# Altium project triumvi_integrated_v2_base.PrjPcb
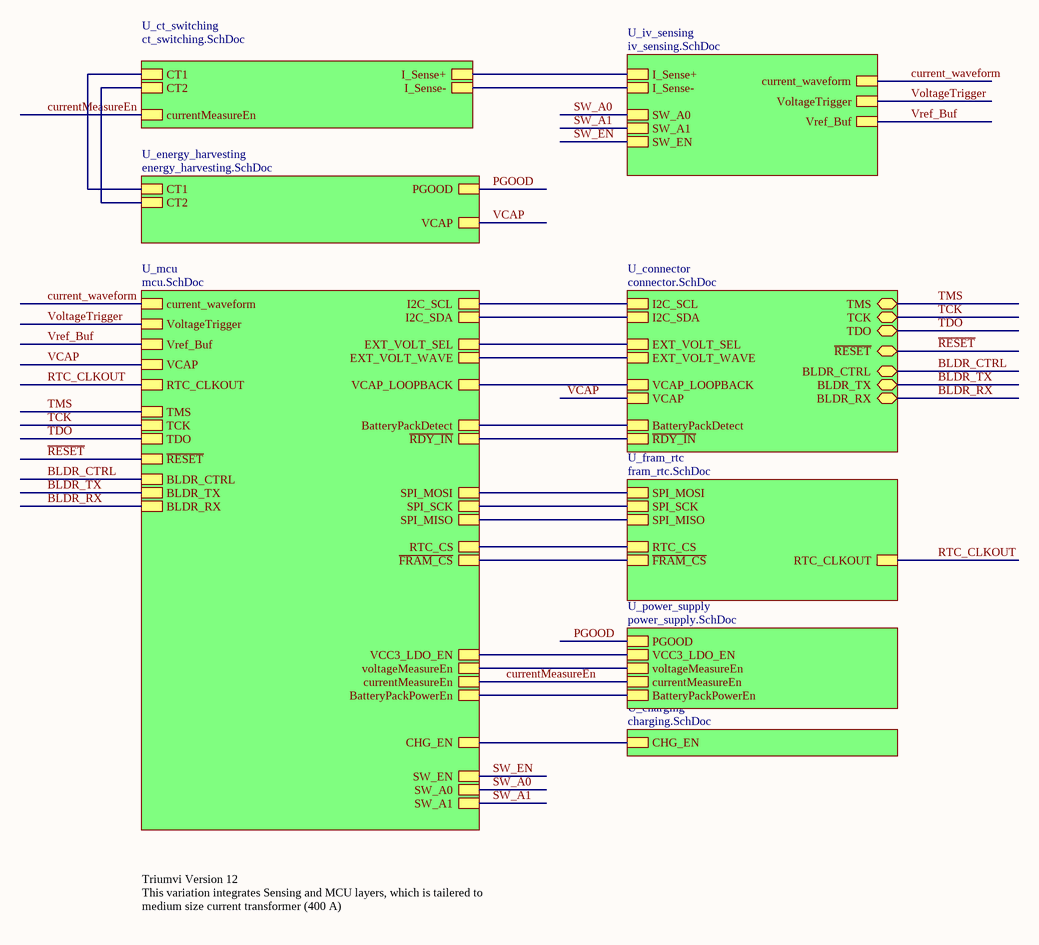
[diagram p0: top.SchDoc]
9 sheets, 139 parts. Net scope: hierarchical (ports join the sheet entries above them; power ports are global).
Board files: triumvi_integrated_v2_base.PcbDoc, triumvi_integrated_v2_base_panel.PcbDoc
Sheets:
  top.SchDoc
    U_charging = charging.SchDoc
    U_connector = connector.SchDoc
    U_ct_switching = ct_switching.SchDoc
    U_energy_harvesting = energy_harvesting.SchDoc
    U_fram_rtc = fram_rtc.SchDoc
    U_iv_sensing = iv_sensing.SchDoc
    U_mcu = mcu.SchDoc
    U_power_supply = power_supply.SchDoc

## Sheet top.SchDoc: Triumvi - Top
size Letter; Author: Ye-Sheng Kuo; Revision: 12; SheetNumber: 1; SheetTotal: 9

### Sub-sheets
U_charging = charging.SchDoc: CHG_EN
U_connector = connector.SchDoc: I2C_SCL, I2C_SDA, EXT_VOLT_SEL, EXT_VOLT_WAVE, BatteryPackDetect, VCAP_LOOPBACK, VCAP, ~{RDY_IN}, TMS, TCK, TDO, BLDR_CTRL, BLDR_TX, BLDR_RX, ~{RESET}
U_ct_switching = ct_switching.SchDoc: CT1, CT2, currentMeasureEn, I_Sense+, I_Sense-
U_energy_harvesting = energy_harvesting.SchDoc: CT1, CT2, PGOOD, VCAP
U_fram_rtc = fram_rtc.SchDoc: SPI_MOSI, SPI_SCK, SPI_MISO, RTC_CS, ~{FRAM_CS}, RTC_CLKOUT
U_iv_sensing = iv_sensing.SchDoc: current_waveform, Vref_Buf, VoltageTrigger, I_Sense+, I_Sense-, SW_A0, SW_A1, SW_EN
U_mcu = mcu.SchDoc: current_waveform, Vref_Buf, voltageMeasureEn, currentMeasureEn, VoltageTrigger, ~{FRAM_CS}, SPI_SCK, SPI_MOSI, SPI_MISO, RTC_CS, I2C_SCL, I2C_SDA, EXT_VOLT_SEL, EXT_VOLT_WAVE, TDO, BLDR_CTRL, BLDR_TX, BLDR_RX, ~{RESET}, TMS, TCK, VCC3_LDO_EN, BatteryPackDetect, VCAP_LOOPBACK, VCAP, ~{RDY_IN}, SW_EN, RTC_CLKOUT, SW_A0, SW_A1, CHG_EN, BatteryPackPowerEn
U_power_supply = power_supply.SchDoc: PGOOD, VCC3_LDO_EN, voltageMeasureEn, currentMeasureEn, BatteryPackPowerEn

### Nets
BatteryPackDetect: sheet U_connector/BatteryPackDetect, sheet U_mcu/BatteryPackDetect
BLDR_CTRL: sheet U_connector/BLDR_CTRL, sheet U_mcu/BLDR_CTRL  [project net BLD_CTRL]
BLDR_RX: sheet U_connector/BLDR_RX, sheet U_mcu/BLDR_RX  [project net BLD_RX]
BLDR_TX: sheet U_connector/BLDR_TX, sheet U_mcu/BLDR_TX  [project net BLD_TX]
CT1: sheet U_ct_switching/CT1, sheet U_energy_harvesting/CT1
CT2: sheet U_ct_switching/CT2, sheet U_energy_harvesting/CT2
current_waveform: sheet U_iv_sensing/current_waveform, sheet U_mcu/current_waveform
currentMeasureEn: sheet U_ct_switching/currentMeasureEn, sheet U_mcu/currentMeasureEn, sheet U_power_supply/currentMeasureEn
EXT_VOLT_SEL: sheet U_connector/EXT_VOLT_SEL, sheet U_mcu/EXT_VOLT_SEL
EXT_VOLT_WAVE: sheet U_connector/EXT_VOLT_WAVE, sheet U_mcu/EXT_VOLT_WAVE
I2C_SCL: sheet U_connector/I2C_SCL, sheet U_mcu/I2C_SCL
I2C_SDA: sheet U_connector/I2C_SDA, sheet U_mcu/I2C_SDA
in+: sheet U_ct_switching/I_Sense+, sheet U_iv_sensing/I_Sense+
in-: sheet U_ct_switching/I_Sense-, sheet U_iv_sensing/I_Sense-
PGOOD: sheet U_energy_harvesting/PGOOD, sheet U_power_supply/PGOOD
~{RDY_IN}: sheet U_connector/~{RDY_IN}, sheet U_mcu/~{RDY_IN}
~{RESET}: sheet U_connector/~{RESET}, sheet U_mcu/~{RESET}
RTC_CLKOUT: sheet U_fram_rtc/RTC_CLKOUT, sheet U_mcu/RTC_CLKOUT
RTC_CS: sheet U_fram_rtc/RTC_CS, sheet U_mcu/RTC_CS
SPI_CLK: sheet U_fram_rtc/SPI_SCK, sheet U_mcu/SPI_SCK
SPI_MISO: sheet U_fram_rtc/SPI_MISO, sheet U_mcu/SPI_MISO
SPI_MOSI: sheet U_fram_rtc/SPI_MOSI, sheet U_mcu/SPI_MOSI
SW_A0: sheet U_iv_sensing/SW_A0, sheet U_mcu/SW_A0
SW_A1: sheet U_iv_sensing/SW_A1, sheet U_mcu/SW_A1
SW_EN: sheet U_iv_sensing/SW_EN, sheet U_mcu/SW_EN
TCK: sheet U_connector/TCK, sheet U_mcu/TCK
TDO: sheet U_connector/TDO, sheet U_mcu/TDO
TMS: sheet U_connector/TMS, sheet U_mcu/TMS
VCAP: sheet U_connector/VCAP, sheet U_energy_harvesting/VCAP, sheet U_mcu/VCAP
VCAP_LOOPBACK: sheet U_connector/VCAP_LOOPBACK, sheet U_mcu/VCAP_LOOPBACK
voltageMeasureEn: sheet U_mcu/voltageMeasureEn, sheet U_power_supply/voltageMeasureEn
VoltageTrigger: sheet U_iv_sensing/VoltageTrigger, sheet U_mcu/VoltageTrigger
Vref_Buf: sheet U_iv_sensing/Vref_Buf, sheet U_mcu/Vref_Buf
NetQ13_5: sheet U_mcu/BatteryPackPowerEn, sheet U_power_supply/BatteryPackPowerEn
NetR4_1: sheet U_charging/CHG_EN, sheet U_mcu/CHG_EN
NetU4_1: sheet U_fram_rtc/~{FRAM_CS}, sheet U_mcu/~{FRAM_CS}
NetU9_11: sheet U_mcu/VCC3_LDO_EN, sheet U_power_supply/VCC3_LDO_EN

### Notes on the sheet
- Triumvi Version 12
  This variation integrates Sensing and MCU layers, which is tailered to medium size current transformer (400 A)
- Title
- Date:
- Author:
- Revision:
- Sheet
- of
- University of Michigan
- File:

## Sheet charging.SchDoc: Triumvi - Charging
size Letter; Author: Ye-Sheng Kuo; Revision: 12; SheetNumber: 9; SheetTotal: 9
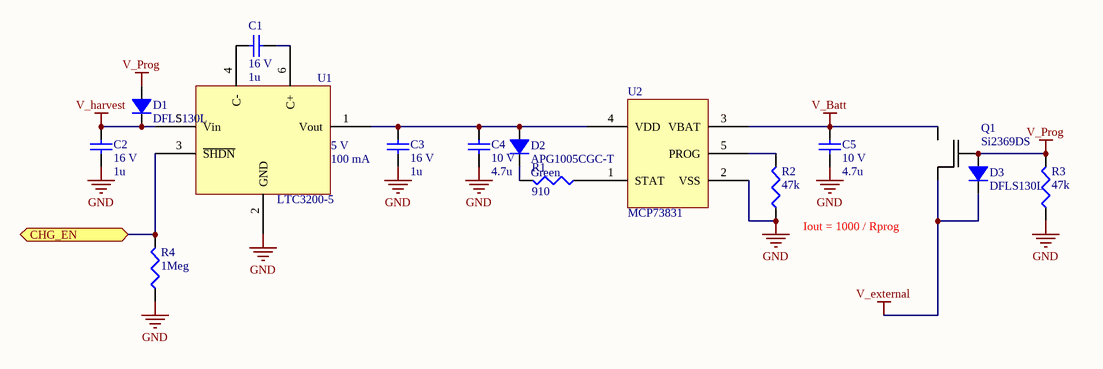
[diagram p1: charging.SchDoc]

### Parts
C1  voltage rated: 16 V  [0603]  (hidden comment: 1u)
C2  voltage rated: 16 V  [0603]  (hidden comment: 1u)
C3  voltage rated: 16 V  [0603]  (hidden comment: 1u)
C4  voltage rated: 10 V  [0603]  (hidden comment: 4.7u)
C5  voltage rated: 10 V  [0603]  (hidden comment: 4.7u)
D1  DFLS130L  [PowerDI123]
D2  APG1005CGC-T  value Green  [0402 - LED]
D3  DFLS130L  [PowerDI123]
Q1  Si2369DS  [SOT23-3]
R1  910  [0402]
R2  47k  [0402]
R3  47k  [0402]
R4  1Meg  [0402]
U1  LTC3200-5  Vout: 5 V  Iout: 100 mA  [SOT23-6]
U2  MCP73831  [TSOT23-5]

### Ports
CHG_EN

### Nets
GND: C2.1 C3.1 C4.2 C5.2 R2.2 R3.2 R4.2 U1.2(GND) U2.2(VSS)
V_Batt: C5.1 Q1.2(S) U2.3(VBAT)
V_external: D3.2 Q1.3(D)
V_harvest: C2.2 D1.2 U1.5(Vin)
V_Prog: D1.1 D3.1 Q1.1(G) R3.1
NetC1_1: C1.1 U1.4(C-)
NetC1_2: C1.2 U1.6(C+)
NetC3_2: C3.2 C4.1 D2.1 U1.1(Vout) U2.4(VDD)
NetD2_2: D2.2 R1.1
NetR1_2: R1.2 U2.1(STAT)
NetR2_1: R2.1 U2.5(PROG)
NetR4_1: R4.1 U1.3(~{SHDN}) ; port CHG_EN

### Notes on the sheet
- (near R2) Iout = 1000 / Rprog
- Title
- Date:
- Author:
- Revision:
- Sheet
- of
- University of Michigan
- File:

### Library data of the parts
C1-C3 = C1608X7R1C105K080AC: 1µF ±10% 16V Ceramic Capacitor X7R 0603; Manufacture: TDK; tolerance: 10%; package: 0603; Temperature Coefficient: X7R; Manufacturer Part Number: C1608X7R1C105K080AC; Supplier 1: Digi-Key; Supplier Part Number 1: 445-1604-1-ND; Value: 1u
C4 C5 = CGB3B1X5R1A475K055AC: 4.7µF ±10% 10V Ceramic Capacitor X5R 0603; Manufacture: TDK; tolerance: 10%; package: 0603; Supplier 1: Digi-Key; Supplier Part Number 1: 445-7482-1-ND; Value: 4.7u; Temperature Coefficient: X5R; Manufacturer Part Number: CGB3B1X5R1A475K055AC
D1 D3 = DFLS130L: 1.0A SURFACE MOUNT SCHOTTKY BARRIER RECTIFIER; Manufacturer: Diodes Incorporated; Forward Voltage @ If: 0.21 V @ 0.1 A; reverse current: 0.26 mA @ 5V; power: 556 mW; Manufacturer Part Number: DFLS130L; diode type: SCHOTTKY BARRIER; Supplier 1: Digi-Key; Supplier Part Number 1: DFLS130LDICT-ND
D2 = APG1005CGC-T: Green 571nm LED Indication - Discrete 2V 0402 (1005 Metric); Manufacturer: Kingbright; Current @ VF: 20 mA; package: 0402; Forward Voltage: 2 V; Manufacturer Part Number: APG1005CGC-T; Wavelength: 571 nm; Supplier 1: Digi-Key; Supplier Part Number 1: 754-1811-1-ND
Q1 = Si2369DS: P-Channel 30-V (D-S) MOSFET; Supplier 1: Digi-Key; Supplier Part Number 1: SI2369DS-T1-GE3CT-ND
R1 = CRCW0402910RFKED: RES SMD 910 OHM 1% 1/16W 0402; Manufacturer: Vishay Dale; Temperature Coefficient: 100 ppm/C; Tolerance: 1%; Power: 1/16 W; package: 0402; Supplier 1: Digi-Key; Supplier Part Number 1: 541-910LCT-ND; value: 910; Manufacturer Part Number: CRCW0402910RFKED
R2 R3 = CRCW040247K0FKED: RES SMD 47K OHM 1% 1/16W 0402; Manufacturer: Vishay Dale; Temperature Coefficient: 100 ppm/C; Tolerance: 1%; Power: 1/16 W; package: 0402; Supplier 1: Digi-Key; Supplier Part Number 1: 541-47.0KLCT-ND; value: 47k; Manufacturer Part Number: CRCW040247K0FKED
R4 = CRCW04021M00FKED: RES SMD 1M OHM 1% 1/16W 0402; Manufacturer: Vishay Dale; Temperature Coefficient: 100 ppm/C; Tolerance: 1%; Power: 1/16 W; Supplier 1: Digi-Key; Supplier Part Number 1: 541-1.00MLCT-ND; package: 0402; value: 1Meg; Manufacturer Part Number: CRCW04021M00FKED
U1 = LTC3200ES6-5#TRMPBF: Low Noise, Regulated   Charge Pump DC/DC Converters; Supplier 1: Digi-Key; Supplier Part Number 1: LTC3200ES6-5#TRMPBFCT-ND
U2 = MCP73831: Miniature Single-Cell, Fully Integrated Li-Ion,  Li-Polymer Charge Management Controllers; Supplier 1: Digi-Key; Supplier Part Number 1: MCP73831T-2ATI/OTCT-ND

## Sheet connector.SchDoc: Triumvi - Connectors
size Letter; Author: Ye-Sheng Kuo; Revision: 12; SheetNumber: 8; SheetTotal: 9
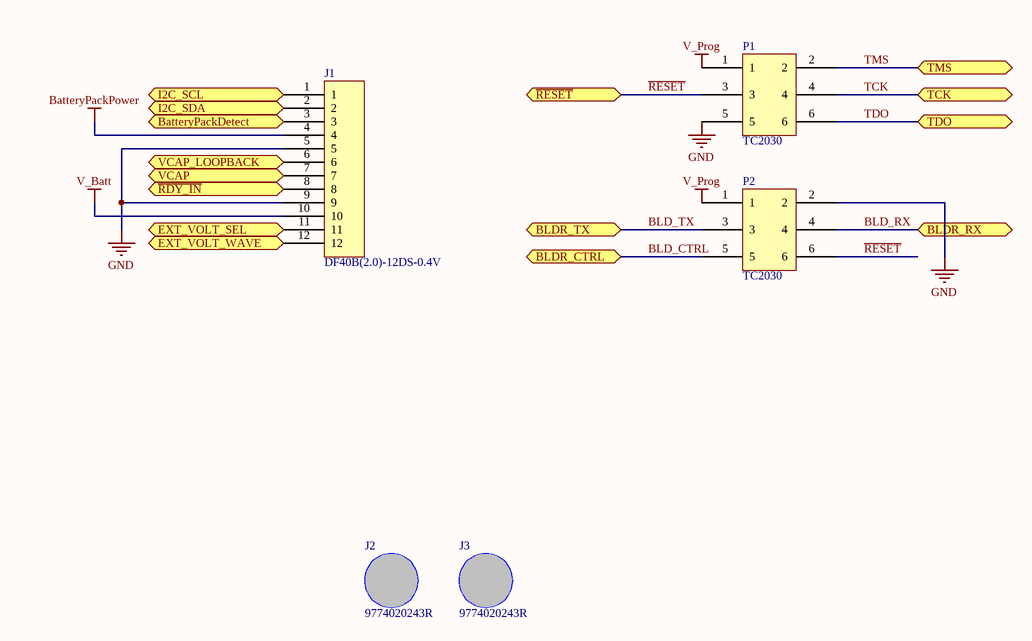
[diagram p2: connector.SchDoc]

### Parts
J1  DF40B(2.0)-12DS-0.4V  [DF40B(2.0)-12DS-0.4V]
J2  9774020243R  [9774020243R]
J3  9774020243R  [9774020243R]
P1  TC2030  [TC2030-IDC-NLFP]
P2  TC2030  [TC2030-IDC-NLFP]

### Ports
BatteryPackDetect, BLDR_CTRL, BLDR_RX, BLDR_TX, EXT_VOLT_SEL, EXT_VOLT_WAVE, I2C_SCL, I2C_SDA, TCK, TDO, TMS, VCAP, VCAP_LOOPBACK, ~{RDY_IN}, ~{RESET}

### Nets
BatteryPackPower: J1.4
GND: J1.5 J1.9 P1.5 P2.2
V_Batt: J1.10
V_Prog: P1.1 P2.1
BatteryPackDetect: J1.3 ; port BatteryPackDetect
BLD_CTRL: P2.5 ; port BLDR_CTRL
BLD_RX: P2.4 ; port BLDR_RX
BLD_TX: P2.3 ; port BLDR_TX
EXT_VOLT_SEL: J1.11 ; port EXT_VOLT_SEL
EXT_VOLT_WAVE: J1.12 ; port EXT_VOLT_WAVE
I2C_SCL: J1.1 ; port I2C_SCL
I2C_SDA: J1.2 ; port I2C_SDA
~{RDY_IN}: J1.8 ; port ~{RDY_IN}
~{RESET}: P1.3 P2.6 ; port ~{RESET}
TCK: P1.4 ; port TCK
TDO: P1.6 ; port TDO
TMS: P1.2 ; port TMS
VCAP: J1.7 ; port VCAP
VCAP_LOOPBACK: J1.6 ; port VCAP_LOOPBACK

### Notes on the sheet
- Title
- Date:
- Author:
- Revision:
- Sheet
- of
- University of Michigan
- File:

### Library data of the parts
J1 = DF40B(2.0)-12DS-0.4V: Hirose BM20 Series, 0.4mm pitch, 2mm stack height, 12 pos, header; Supplier 1: Digi-Key; Supplier Part Number 1: H124594CT-ND
J2 J3 = 9774020243R: 2 mm stack height, m2 standoff; Supplier 1: Digi-Key; Supplier Part Number 1: 732-7073-1-ND
P1 P2 = TC2030: TC2030-MCP-NL; Note: Not a part

## Sheet ct_switching.SchDoc: Triumvi - CT Switching
size Letter; Author: Ye-Sheng Kuo; Revision: 12; SheetNumber: 7; SheetTotal: 9
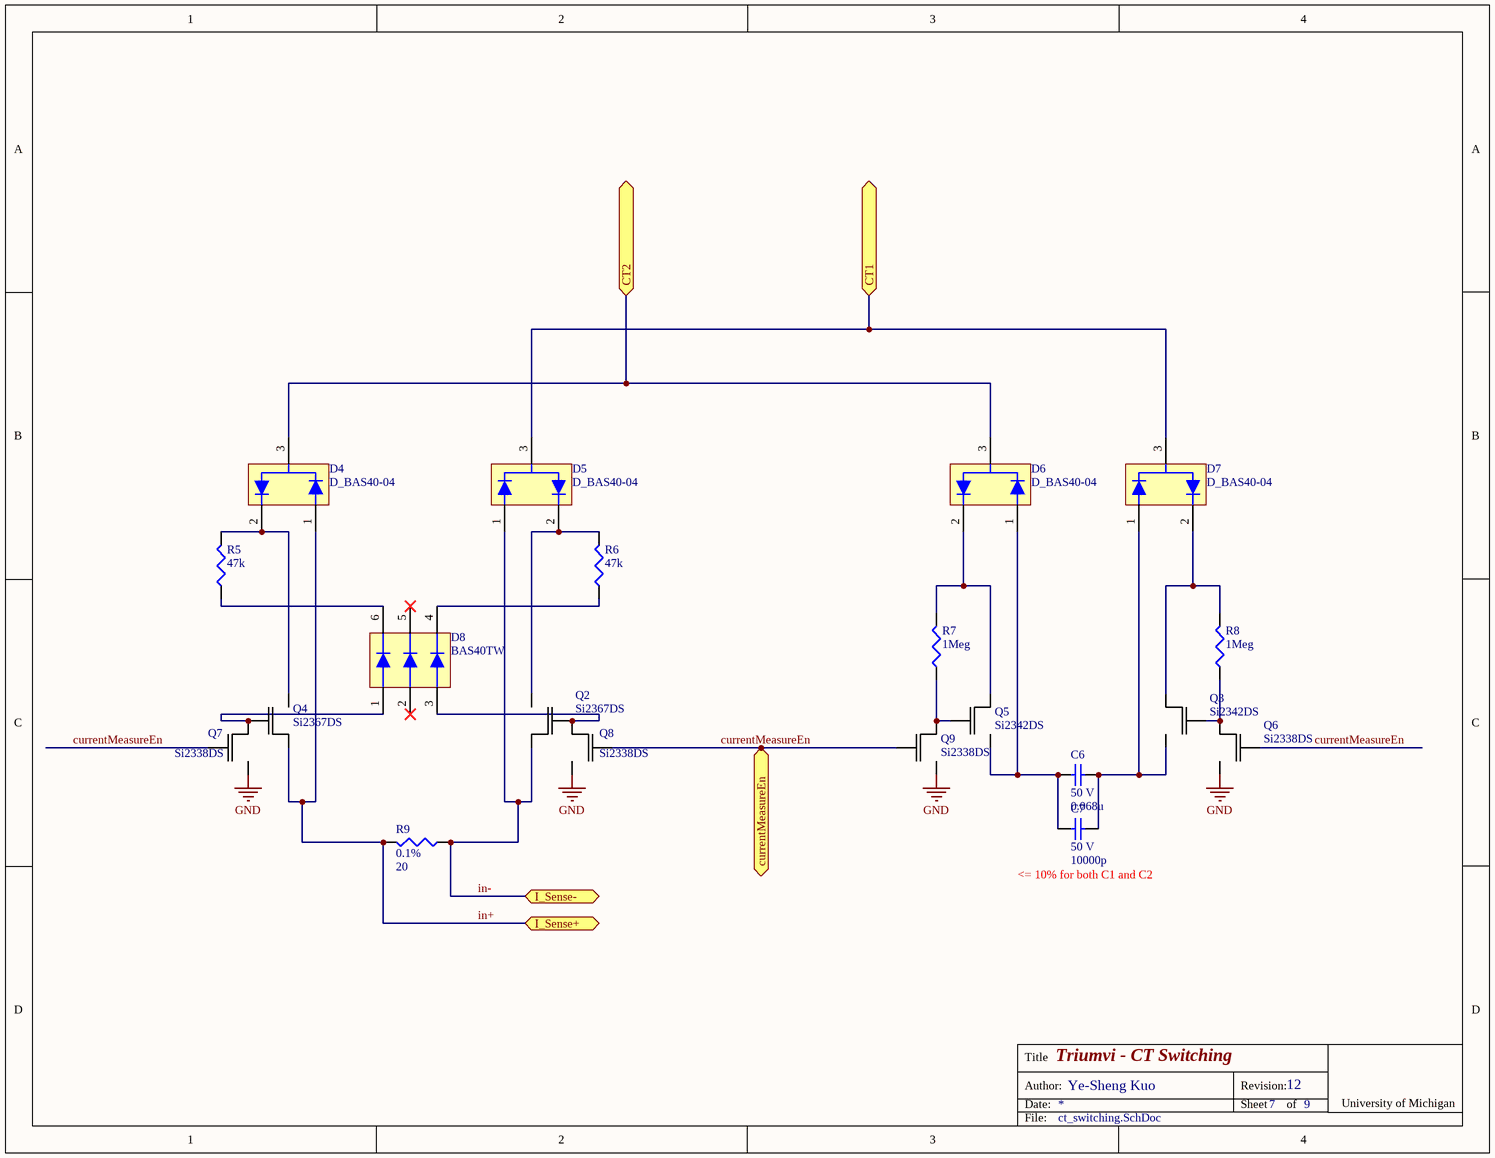
[diagram p3: ct_switching.SchDoc]

### Parts
C6  voltage rated: 50 V  [0603]  (hidden comment: 0.068u)
C7  voltage rated: 50 V  [0603]  (hidden comment: 10000p)
D4  D_BAS40-04  [SOT23-3]
D5  D_BAS40-04  [SOT23-3]
D6  D_BAS40-04  [SOT23-3]
D7  D_BAS40-04  [SOT23-3]
D8  BAS40TW  [SOT-363]
Q2  Si2367DS  [SOT23-3]
Q3  Si2342DS  [SOT23-3]
Q4  Si2367DS  [SOT23-3]
Q5  Si2342DS  [SOT23-3]
Q6  Si2338DS  [SOT23-3]
Q7  Si2338DS  [SOT23-3]
Q8  Si2338DS  [SOT23-3]
Q9  Si2338DS  [SOT23-3]
R5  47k  [0402]
R6  47k  [0402]
R7  1Meg  [0402]
R8  1Meg  [0402]
R9  Tolerance: 0.1%  [0805]  (hidden comment: 20)

### Ports
CT1, CT2, currentMeasureEn, I_Sense+, I_Sense-

### Nets
GND: Q6.2(S) Q7.2(S) Q8.2(S) Q9.2(S)
CT1: D5.3 D7.3 ; port CT1
CT2: D4.3 D6.3 ; port CT2
currentMeasureEn: Q6.1(G) Q7.1(G) Q8.1(G) Q9.1(G) ; port currentMeasureEn
in+: D4.1 Q4.3(D) R9.1 ; port I_Sense+
in-: D5.1 Q2.3(D) R9.2 ; port I_Sense-
NetC6_1: C6.1 C7.1 D6.1 Q5.2(S)
NetC6_2: C6.2 C7.2 D7.1 Q3.2(S)
NetD4_2: D4.2 Q4.2(S) R5.1
NetD5_2: D5.2 Q2.2(S) R6.1
NetD6_2: D6.2 Q5.3(D) R7.1
NetD7_2: D7.2 Q3.3(D) R8.1
NetD8_1: D8.1 Q4.1(G) Q7.3(D)
NetD8_3: D8.3 Q2.1(G) Q8.3(D)
NetD8_4: D8.4 R6.2
NetD8_6: D8.6 R5.2
NetQ3_1: Q3.1(G) Q6.3(D) R8.2
NetQ5_1: Q5.1(G) Q9.3(D) R7.2

Not connected (* = marked no-connect by the designer): D8 2* 5*

### Notes on the sheet
- (near C7) <= 10% for both C1 and C2
- Title
- Date:
- Author:
- Revision:
- Sheet
- of
- University of Michigan
- File:

### Library data of the parts
C6 = C0603C683K5RACTU: 0.068µF ±10% 50V Ceramic Capacitor X7R 0603; Manufacture: Kemet; tolerance: 10%; package: 0603; Supplier 1: Digi-Key; Supplier Part Number 1: 399-7955-1-ND; Value: 0.068u; Temperature Coefficient: X7R; Manufacturer Part Number: C0603C683K5RACTU
C7 = C0603C103J5RACTU: 10000pF ±5% 50V Ceramic Capacitor X7R 0603; Manufacture: Kemet; tolerance: 5%; package: 0603; Supplier 1: Digi-Key; Supplier Part Number 1: 399-1092-6-ND; Value: 10000p; Temperature Coefficient: X7R; Manufacturer Part Number: C0603C103J5RACTU
D4-D7 = D_BAS40-04: SURFACE MOUNT SCHOTTKY BARRIER DIODE; Supplier 1: Digi-Key; Supplier Part Number 1: BAS40-04FDICT-ND
D8 = D_BAS40TW: SURFACE MOUNT SCHOTTKY BARRIER DIODE ARRAYS; Supplier 1: Digi-Key; Supplier Part Number 1: BAS40TW-FDICT-ND
Q2 Q4 = Si2367DS: P-Channel 20 V (D-S) MOSFET; Supplier 1: Digi-Key; Supplier Part Number 1: SI2367DS-T1-GE3CT-ND
Q3 Q5 = Si2342DS: N-Channel 8 V (D-S) MOSFET; Supplier 1: Digi-Key; Supplier Part Number 1: SI2342DS-T1-GE3CT-ND
Q6-Q9 = Si2338DS: N-Channel 30 V (D-S) MOSFET; Supplier 1: Digi-Key; Supplier Part Number 1: SI2338DS-T1-GE3CT-ND
R5 R6 = CRCW040247K0FKED: as R2 on sheet charging; Tolerance: 1%; Power: 1/16 W; package: 0402; Supplier 1: Digi-Key; Supplier Part Number 1: 541-47.0KLCT-ND; value: 47k; Manufacturer Part Number: CRCW040247K0FKED
R7 R8 = CRCW04021M00FKED: as R4 on sheet charging; Tolerance: 1%; Power: 1/16 W; Supplier 1: Digi-Key; Supplier Part Number 1: 541-1.00MLCT-ND; package: 0402; value: 1Meg; Manufacturer Part Number: CRCW04021M00FKED
R9 = RTAN0805BKE20R0: RES SMD 20 OHM 0.1% 1/5W 0805; Manufacturer: Stackpole Electronics Inc.; Temperature Coefficient: 25 ppm/C; Power: 0.2 W; package: 0805; Manufacturer Part Number: RTAN0805BKE20R0; Supplier 1: Digi-Key; Supplier Part Number 1: RTAN0805BKE20R0CT-ND; value: 20

## Sheet energy_harvesting.SchDoc: Triumvi - Energy harvesting
size Letter; Author: Ye-Sheng Kuo; Revision: 12; SheetNumber: 6; SheetTotal: 9
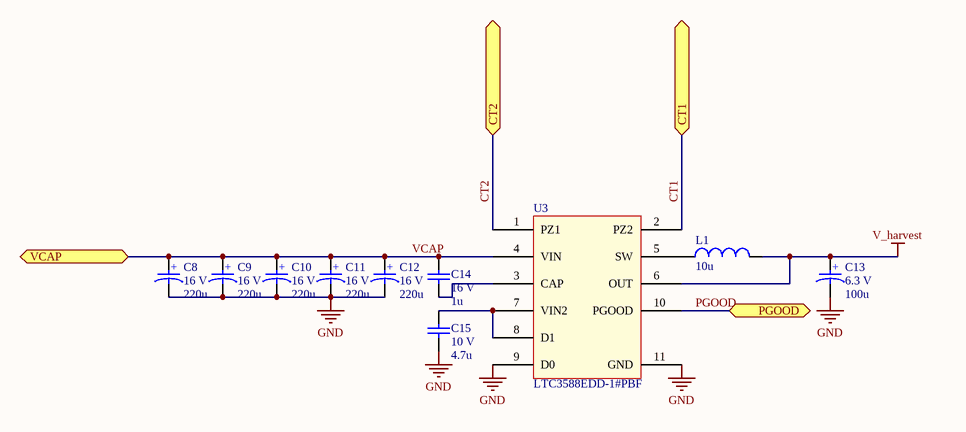
[diagram p4: energy_harvesting.SchDoc]

### Parts
C8  voltage rated: 16 V  [2917]  (hidden comment: 220u)
C9  voltage rated: 16 V  [2917]  (hidden comment: 220u)
C10  voltage rated: 16 V  [2917]  (hidden comment: 220u)
C11  voltage rated: 16 V  [2917]  (hidden comment: 220u)
C12  voltage rated: 16 V  [2917]  (hidden comment: 220u)
C13  voltage rated: 6.3 V  [1206 - POLAR MARKING]  (hidden comment: 100u)
C14  voltage rated: 16 V  [0603]  (hidden comment: 1u)
C15  voltage rated: 10 V  [0603]  (hidden comment: 4.7u)
L1  10u  [CDRH2D18]
U3  LTC3588EDD-1#PBF  [QFN-10]

### Ports
CT1, CT2, PGOOD, VCAP

### Nets
GND: C8.2 C9.2 C10.2 C11.2 C12.2 C13.2 C15.2 U3.9(D0) U3.11(GND)
V_harvest: C13.1 L1.1 U3.6(OUT)
CT1: U3.2(PZ2) ; port CT1
CT2: U3.1(PZ1) ; port CT2
PGOOD: U3.10(PGOOD) ; port PGOOD
VCAP: C8.1 C9.1 C10.1 C11.1 C12.1 C14.1 U3.4(VIN) ; port VCAP
NetC14_2: C14.2 U3.3(CAP)
NetC15_1: C15.1 U3.7(VIN2) U3.8(D1)
NetL1_2: L1.2 U3.5(SW)

### Notes on the sheet
- Title
- Date:
- Author:
- Revision:
- Sheet
- of
- University of Michigan
- File:
- (in symbol F930J107MAA) +
- (in symbol T495X227K016ATE100) +

### Library data of the parts
C8-C12 = T495X227K016ATE100: 220µF ±10% Molded Tantalum Capacitors 16V; Manufacture: Kemet; ESR: 100m Ohm; tolerance: 10%; package: 2917; Supplier 1: Digi-Key; Supplier Part Number 1: 399-10409-1-ND; Value: 220u; Manufacturer Part Number: T495X227K016ATE100
C13 = F930J107MAA: 100µF ±20% Molded Tantalum Capacitors 6.3V 1206; Manufacture: AVX; ESR: 2 Ohm; tolerance: 20%; package: 1206; Supplier 1: Digi-Key; Supplier Part Number 1: 478-8155-1-ND; Value: 100u; Manufacturer Part Number: F930J107MAA
C14 = C1608X7R1C105K080AC: as C1 on sheet charging; tolerance: 10%; package: 0603; Supplier 1: Digi-Key; Supplier Part Number 1: 445-1604-1-ND; Value: 1u; Temperature Coefficient: X7R; Manufacturer Part Number: C1608X7R1C105K080AC
C15 = CGB3B1X5R1A475K055AC: as C4 on sheet charging; tolerance: 10%; package: 0603; Supplier 1: Digi-Key; Supplier Part Number 1: 445-7482-1-ND; Value: 4.7u; Temperature Coefficient: X5R; Manufacturer Part Number: CGB3B1X5R1A475K055AC
L1 = CDRH2D18/LDNP-100NC: 10µH Shielded Inductor 1A 180 mOhm Max Nonstandard; Manufacturer: Sumida; tolerance: 30%; DCR (Max): 180m; Supplier 1: Digi-Key; Supplier Part Number 1: 308-1959-1-ND; Value: 10u; Current Rating: 1 A; Manufacturer Part Number: CDRH2D18/LDNP-100NC
U3 = LTC3588EDD-1#PBF: Piezoelectric Energy Harvesting Power Supply; Supplier 1: Digi-Key; Supplier Part Number 1: LTC3588EDD-1#PBF-ND

## Sheet fram_rtc.SchDoc: Triumvi - FRAM/RTC
size Letter; Author: Ye-Sheng Kuo; Revision: 12; SheetNumber: 5; SheetTotal: 9
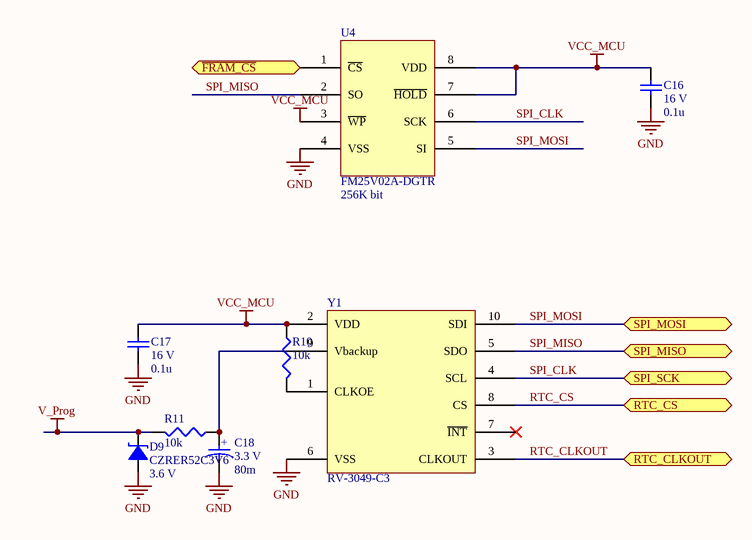
[diagram p5: fram_rtc.SchDoc]

### Parts
C16  voltage rated: 16 V  [0402]  (hidden comment: 0.1u)
C17  voltage rated: 16 V  [0402]  (hidden comment: 0.1u)
C18  voltage rated: 3.3 V  [XH414HG-IV01E]  (hidden comment: 80m)
D9  CZRER52C3V6  Zener Voltage: 3.6 V  [0503/SOD-723F]
R10  10k  [0402]
R11  10k  [0402]
U4  FM25V02A-DGTR  Size: 256K bit  [TDFN-8]
Y1  RV-3049-C3  [RV-3049-C3]

### Ports
RTC_CLKOUT, RTC_CS, SPI_MISO, SPI_MOSI, SPI_SCK, ~{FRAM_CS}

### Nets
GND: C16.2 C17.2 C18.2 D9.1 U4.4(VSS) Y1.6(VSS)
V_Prog: D9.2 R11.1
VCC_MCU: C16.1 C17.1 R10.2 U4.3(~{WP}) U4.7(~{HOLD}) U4.8(VDD) Y1.2(VDD)
RTC_CLKOUT: Y1.3(CLKOUT) ; port RTC_CLKOUT
RTC_CS: Y1.8(CS) ; port RTC_CS
SPI_CLK: U4.6(SCK) Y1.4(SCL) ; port SPI_SCK
SPI_MISO: U4.2(SO) Y1.5(SDO) ; port SPI_MISO
SPI_MOSI: U4.5(SI) Y1.10(SDI) ; port SPI_MOSI
NetC18_1: C18.1 R11.2 Y1.9(Vbackup)
NetR10_1: R10.1 Y1.1(CLKOE)
NetU4_1: U4.1(~{CS}) ; port ~{FRAM_CS}

Not connected (* = marked no-connect by the designer): Y1 7(~{INT})*

### Notes on the sheet
- Title
- Date:
- Author:
- Revision:
- Sheet
- of
- University of Michigan
- File:
- (in symbol XH414HG-IV01E) +

### Library data of the parts
C16 C17 = GRM155R71C104KA88D: 0.10µF ±10% 16V Ceramic Capacitor X7R 0402; Manufacture: Murata; tolerance: 10%; package: 0402; Supplier 1: Digi-Key; Supplier Part Number 1: 490-3261-1-ND; Value: 0.1u; Temperature Coefficient: X7R; Manufacturer Part Number: GRM155R71C104KA88D
C18 = XH414HG-IV01E: 80mF (EDLC) Supercapacitor 3.3V Coin; Manufacture: Seiko Instruments; Supplier 1: Digi-Key; Supplier Part Number 1: 728-1050-1-ND; Value: 80m; Manufacturer Part Number: XH414HG-IV01E
D9 = CZRER52C3V6: Zener Diode 3.6V 150mW ±5% Surface Mount 0503 (1308 Metric); Manufacturer: Comchip Technology; Forward Voltage @ If: 900 mV @ 10 mA; reverse current: 15 uA @ 1 V; Supplier 1: Digi-Key; Supplier Part Number 1: 641-1232-1-ND; Manufacturer Part Number: CZRER52C3V6; diode type: Zener; power: 150 mW
R10 R11 = CRCW040210K0FKED: RES SMD 10K OHM 1% 1/16W 0402; Manufacturer: Vishay Dale; Temperature Coefficient: 100 ppm/C; Tolerance: 1%; Power: 1/16 W; Supplier 1: Digi-Key; Supplier Part Number 1: 541-10.0KLCT-ND; package: 0402; value: 10k; Manufacturer Part Number: CRCW040210K0FKED
U4 = FM25V02A-DGTR: 256-Kbit (32 K × 8) Serial (SPI) F-RAM; Manufacturer: Cypress Semiconductor; Manufactuere part number: FM25V02A-DGTR; Supplier 1: Digi-Key; Supplier Part Number 1: FM25V02A-DGTR-ND
Y1 = RV-3049-C3: Real Time Clock Module with SPI-Bus

## Sheet iv_sensing.SchDoc: Triumvi - I/V Sensing
size Letter; Author: Ye-Sheng Kuo; Revision: 12; SheetNumber: 4; SheetTotal: 9
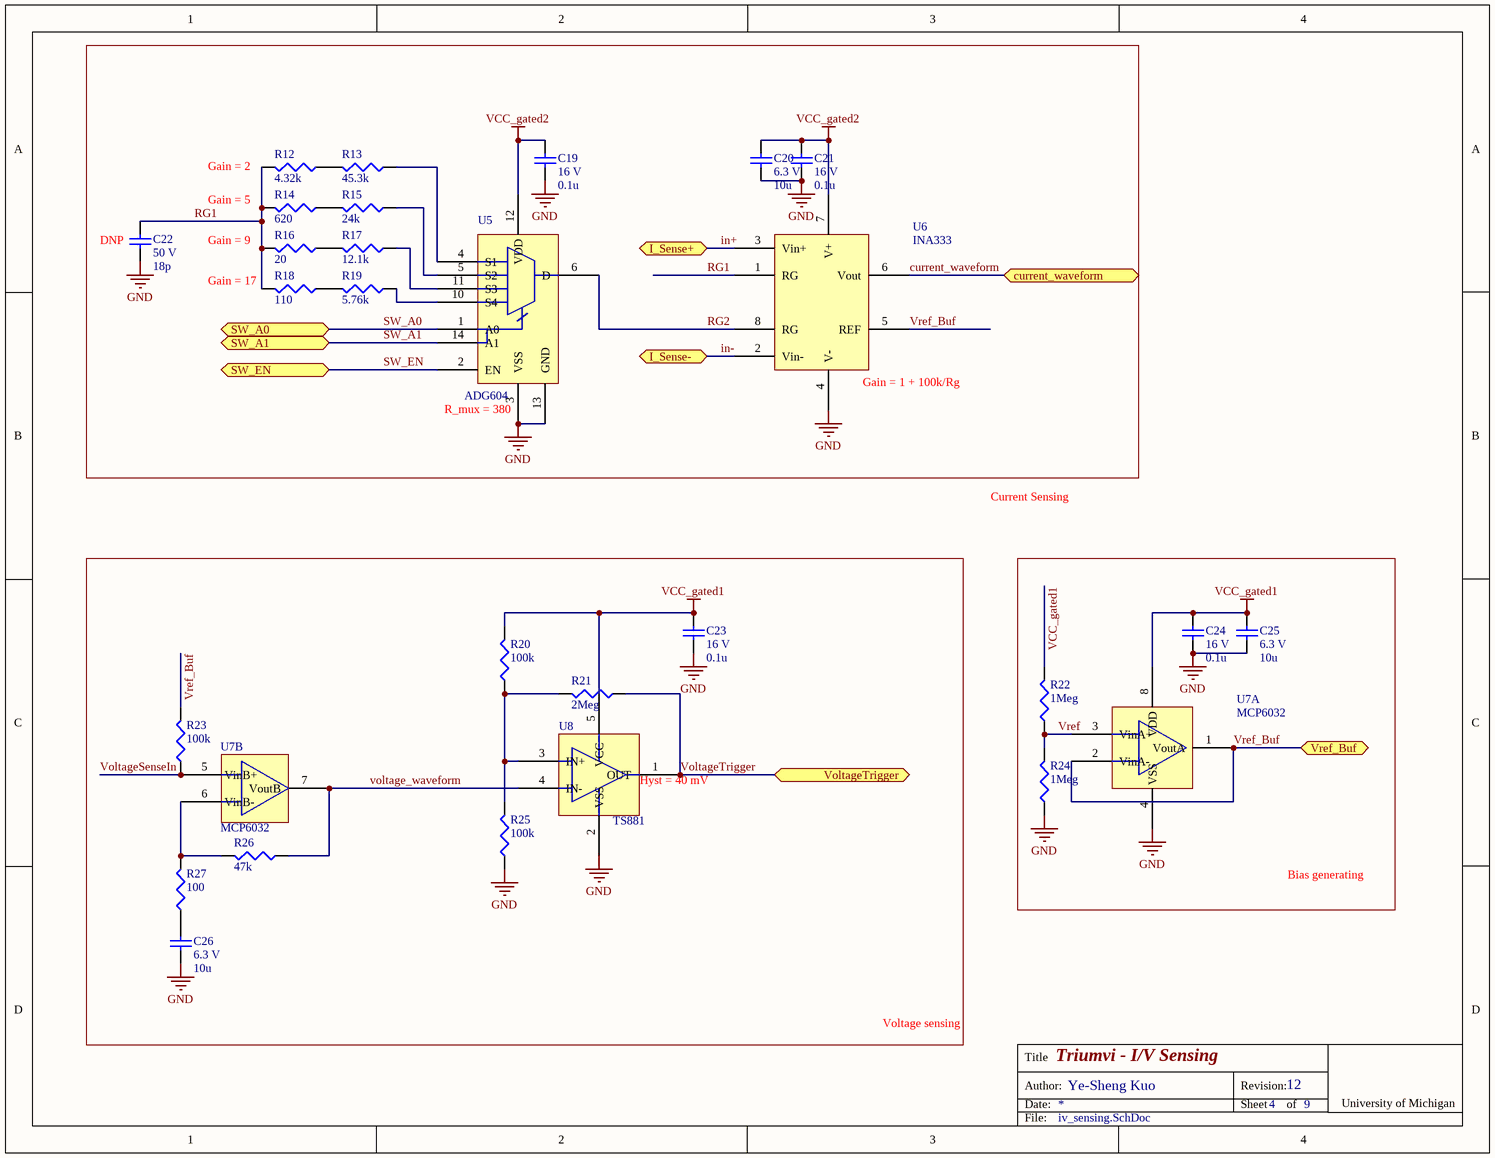
[diagram p6: iv_sensing.SchDoc]

### Parts
C19  voltage rated: 16 V  [0402]  (hidden comment: 0.1u)
C20  voltage rated: 6.3 V  [0603]  (hidden comment: 10u)
C21  voltage rated: 16 V  [0402]  (hidden comment: 0.1u)
C22  voltage rated: 50 V  [0402]  (hidden comment: 18p)
C23  voltage rated: 16 V  [0402]  (hidden comment: 0.1u)
C24  voltage rated: 16 V  [0402]  (hidden comment: 0.1u)
C25  voltage rated: 6.3 V  [0603]  (hidden comment: 10u)
C26  voltage rated: 6.3 V  [0603]  (hidden comment: 10u)
R12  4.32k  [0402]
R13  45.3k  [0402]
R14  620  [0402]
R15  24k  [0402]
R16  20  [0402]
R17  12.1k  [0402]
R18  110  [0402]
R19  5.76k  [0402]
R20  100k  [0402]
R21  2Meg  [0402]
R22  1Meg  [0402]
R23  100k  [0402]
R24  1Meg  [0402]
R25  100k  [0402]
R26  47k  [0402]
R27  100  [0402]
U5  ADG604  [TSSOP-14]
U6  INA333  [MSOP-8]
U7  MCP6032  [MSOP-8]  (parts A,B of 2)
U8  TS881  [SC70-5]

### Blocks framed on the sheet
Bias generating: C24 C25 R22 R24 U7

### Ports
current_waveform, I_Sense+, I_Sense-, SW_A0, SW_A1, SW_EN, VoltageTrigger, Vref_Buf

### Nets
GND: C19.2 C20.2 C21.2 C22.2 C23.2 C24.2 C25.2 C26.2 R24.2 R25.2 U5.3(VSS) U5.13(GND) U6.4(V-) U7.4(VSS) U8.2(VSS)
VCC_gated1: C23.1 C24.1 C25.1 R20.1 R22.1 U7.8(VDD) U8.5(VCC)
VCC_gated2: C19.1 C20.1 C21.1 U5.12(VDD) U6.7(V+)
current_waveform: U6.6(Vout) ; port current_waveform
in+: U6.3(Vin+) ; port I_Sense+
in-: U6.2(Vin-) ; port I_Sense-
RG1: C22.1 R12.1 R14.1 R16.1 R18.1 U6.1(RG)
RG2: U5.6(D) U6.8(RG)
SW_A0: U5.1(A0) ; port SW_A0
SW_A1: U5.14(A1) ; port SW_A1
SW_EN: U5.2(EN) ; port SW_EN
voltage_waveform: R26.2 U7.7(VoutB) U8.4(IN-)
VoltageSenseIn: R23.2 U7.5(VinB+)
VoltageTrigger: R21.2 U8.1(OUT) ; port VoltageTrigger
Vref: R22.2 R24.1 U7.3(VinA+)
Vref_Buf: R23.1 U6.5(REF) U7.1(VoutA) U7.2(VinA-) ; port Vref_Buf
NetC26_1: C26.1 R27.2
NetR12_2: R12.2 R13.1
NetR13_2: R13.2 U5.4(S1)
NetR14_2: R14.2 R15.1
NetR15_2: R15.2 U5.5(S2)
NetR16_2: R16.2 R17.1
NetR17_2: R17.2 U5.11(S3)
NetR18_2: R18.2 R19.1
NetR19_2: R19.2 U5.10(S4)
NetR20_2: R20.2 R21.1 R25.1 U8.3(IN+)
NetR26_1: R26.1 R27.1 U7.6(VinB-)

### Notes on the sheet
- (near R12) Gain = 2
- (near R14) Gain = 5
- (near C22) DNP
- (near R16) Gain = 9
- (near R18) Gain = 17
- (near U5) R_mux = 380
- (near U6) Gain = 1 + 100k/Rg
- Current Sensing
- (near U8) Hyst = 40 mV
- Voltage sensing
- Title
- Date:
- Author:
- Revision:
- Sheet
- of
- University of Michigan
- File:

### Library data of the parts
C19 C21 C23 C24 = GRM155R71C104KA88D: as C16 on sheet fram_rtc; tolerance: 10%; package: 0402; Supplier 1: Digi-Key; Supplier Part Number 1: 490-3261-1-ND; Value: 0.1u; Temperature Coefficient: X7R; Manufacturer Part Number: GRM155R71C104KA88D
C20 C25 C26 = C1608X5R0J106M080AB: 10µF ±20% 6.3V Ceramic Capacitor X5R 0603; Manufacture: TDK; tolerance: 20%; package: 0603; Supplier 1: Digi-Key; Supplier Part Number 1: 445-4112-1-ND; Value: 10u; Temperature Coefficient: X5R; Manufacturer Part Number: C1608X5R0J106M080AB
C22 = 500R07S180GV4T: 18pF ±2% 50V Ceramic Capacitor C0G, NP0 0402; Manufacture: Johanson Technology Inc.; Note: DNP; tolerance: 2%; package: 0402; Temperature Coefficient: C0G, NP0; Manufacturer Part Number: 500R07S180GV4T; Supplier 1: Digi-Key; Supplier Part Number 1: 712-1264-1-ND; Value: 18p
R12 = CRCW04024K32FKED: RES SMD 4.32K OHM 1% 1/16W 0402; Manufacturer: Vishay Dale; Temperature Coefficient: 100 ppm/C; package: 0402; Manufacturer Part Number: CRCW04024K32FKED; Power: 1/16 W; Tolerance: 1%; Supplier 1: Digi-Key; Supplier Part Number 1: 541-4.32KLCT-ND; value: 4.32k
R13 = RT0402DRD0745K3L: RES SMD 45.3KOHM 0.5% 1/16W 0402; Manufacturer: Yageo; Temperature Coefficient: 25 ppm/C; package: 0402; Manufacturer Part Number: RT0402DRD0745K3L; Power: 1/16 W; Tolerance: 0.5%; Supplier 1: Digi-Key; Supplier Part Number 1: YAG4430CT-ND; value: 45.3k
R14 = CRCW0402620RFKED: RES SMD 620 OHM 1% 1/16W 0402; Manufacturer: Vishay Dale; Temperature Coefficient: 100 ppm/C; package: 0402; Manufacturer Part Number: CRCW0402620RFKED; Power: 1/16 W; Tolerance: 1%; Supplier 1: Digi-Key; Supplier Part Number 1: 541-620LCT-ND; value: 620
R15 = RT0402DRE0724KL: RES SMD 24K OHM 0.5% 1/16W 0402; Manufacturer: Yageo; Temperature Coefficient: 50 ppm/C; package: 0402; Manufacturer Part Number: RT0402DRE0724KL; Power: 1/16 W; Tolerance: 0.5%; Supplier 1: Digi-Key; Supplier Part Number 1: 311-2260-1-ND; value: 24k
R16 = CRCW040220R0FKED: RES SMD 20 OHM 1% 1/16W 0402; Manufacturer: Vishay Dale; Temperature Coefficient: 100 ppm/C; package: 0402; Manufacturer Part Number: CRCW040220R0FKED; Power: 1/16 W; Tolerance: 1%; Supplier 1: Digi-Key; Supplier Part Number 1: 541-20.0LCT-ND; value: 20
R17 = CRCW040212K1FKED: RES SMD 12.1K OHM 1% 1/16W 0402; Manufacturer: Vishay Dale; Temperature Coefficient: 100 ppm/C; package: 0402; Manufacturer Part Number: CRCW040212K1FKED; Power: 1/16 W; Tolerance: 1%; Supplier 1: Digi-Key; Supplier Part Number 1: 541-12.1KLCT-ND; value: 12.1k
R18 = CRCW0402110RFKED: RES SMD 110 OHM 1% 1/16W 0402; Manufacturer: Vishay Dale; Temperature Coefficient: 100 ppm/C; package: 0402; Manufacturer Part Number: CRCW0402110RFKED; Power: 1/16 W; Tolerance: 1%; Supplier 1: Digi-Key; Supplier Part Number 1: 541-110LCT-ND; value: 110
R19 = RC0402FR-075K76L: RES SMD 5.76K OHM 0.5% 1/16W 0402; Manufacturer: Yageo; Temperature Coefficient: 100 ppm/C; Tolerance: 1%; package: 0402; Manufacturer Part Number: RC0402FR-075K76L; Power: 1/16 W; Supplier 1: Digi-Key; Supplier Part Number 1: YAG3196CT-ND; value: 5.76k
R20 R23 R25 = CRCW0402100KFKED: RES SMD 100K OHM 1% 1/16W 0402; Manufacturer: Vishay Dale; Temperature Coefficient: 100 ppm/C; Tolerance: 1%; Power: 1/16 W; Supplier 1: Digi-Key; Supplier Part Number 1: 541-100KLCT-ND; package: 0402; value: 100k; Manufacturer Part Number: CRCW0402100KFKED
R21 = CRCW04022M00FKED: RES SMD 2M OHM 1% 1/16W 0402; Manufacturer: Vishay Dale; Temperature Coefficient: 100 ppm/C; Tolerance: 1%; Power: 1/16 W; package: 0402; Supplier 1: Digi-Key; Supplier Part Number 1: 541-2.00MLCT-ND; value: 2Meg; Manufacturer Part Number: CRCW04022M00FKED
R22 R24 = CRCW04021M00FKED: as R4 on sheet charging; Tolerance: 1%; Power: 1/16 W; Supplier 1: Digi-Key; Supplier Part Number 1: 541-1.00MLCT-ND; package: 0402; value: 1Meg; Manufacturer Part Number: CRCW04021M00FKED
R26 = CRCW040247K0FKED: as R2 on sheet charging; Tolerance: 1%; Power: 1/16 W; package: 0402; Supplier 1: Digi-Key; Supplier Part Number 1: 541-47.0KLCT-ND; value: 47k; Manufacturer Part Number: CRCW040247K0FKED
R27 = CRCW0402100RFKED: RES SMD 100 OHM 1% 1/16W 0402; Manufacturer: Vishay Dale; Temperature Coefficient: 100 ppm/C; Tolerance: 1%; Power: 1/16 W; package: 0402; Supplier 1: Digi-Key; Supplier Part Number 1: 541-100LCT-ND; value: 100; Manufacturer Part Number: CRCW0402100RFKED
U5 = ADG604: 1 pC Charge Injection, 100 pA Leakage  CMOS  5 V/5 V/3 V 4-Channel Multiplexer; Supplier 1: Digi-Key; Supplier Part Number 1: ADG604YRUZ-ND
U6 = INA333: Micro-Power (50uA), Zero-Drift, Rail-to-Rail Out  Instrumentation Amplifier; Supplier 1: Digi-Key; Supplier Part Number 1: 296-23564-1-ND
U7 = MCP6032: 0.9 µA, High Precision Op Amps; Supplier 1: Digi-Key; Supplier Part Number 1: MCP6032-E/MS-ND
U8 = TS881: Rail-to-rail 0.9 V nanopower comparator; Supplier 1: Digi-Key; Supplier Part Number 1: 497-13217-1-ND

## Sheet mcu.SchDoc: Triumvi - MCU
size Letter; Author: Ye-Sheng Kuo; Revision: 12; SheetNumber: 3; SheetTotal: 9
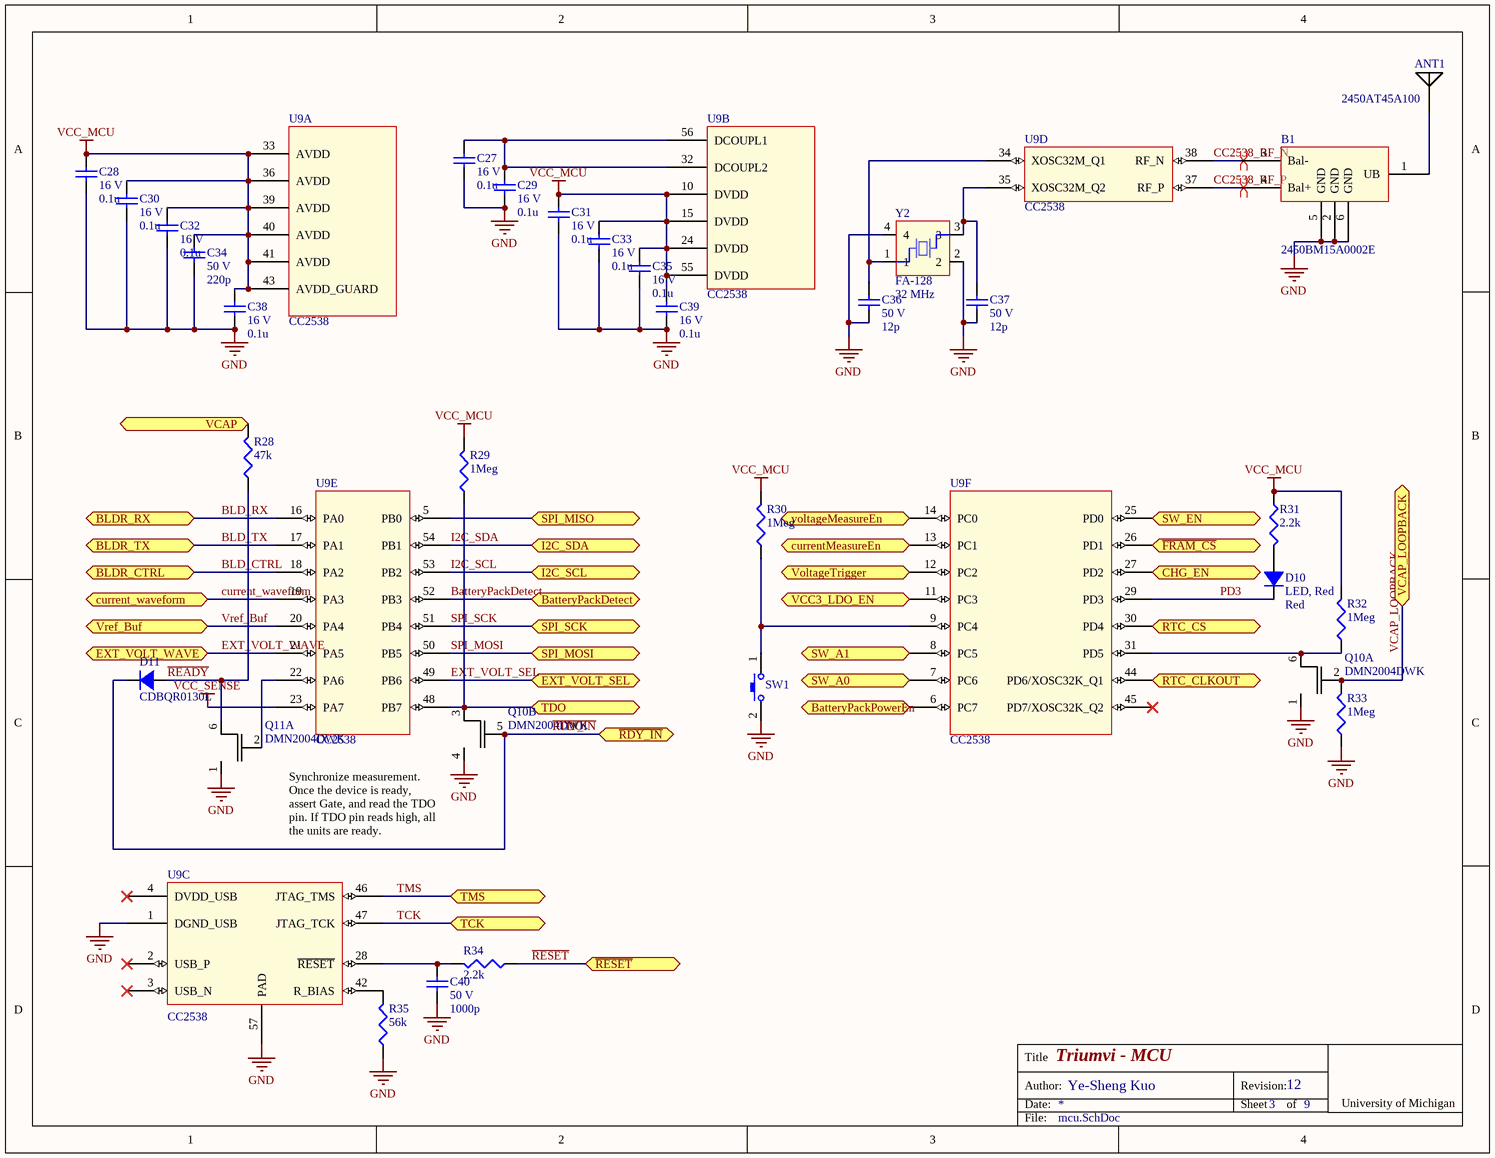
[diagram p7: mcu.SchDoc]

### Parts
ANT1  2450AT45A100  [2450AT45A100]
B1  2450BM15A0002E  [2450BM15A0002]
C27  voltage rated: 16 V  [0402]  (hidden comment: 0.1u)
C28  voltage rated: 16 V  [0402]  (hidden comment: 0.1u)
C29  voltage rated: 16 V  [0402]  (hidden comment: 0.1u)
C30  voltage rated: 16 V  [0402]  (hidden comment: 0.1u)
C31  voltage rated: 16 V  [0402]  (hidden comment: 0.1u)
C32  voltage rated: 16 V  [0402]  (hidden comment: 0.1u)
C33  voltage rated: 16 V  [0402]  (hidden comment: 0.1u)
C34  voltage rated: 50 V  [0402]  (hidden comment: 220p)
C35  voltage rated: 16 V  [0402]  (hidden comment: 0.1u)
C36  voltage rated: 50 V  [0402]  (hidden comment: 12p)
C37  voltage rated: 50 V  [0402]  (hidden comment: 12p)
C38  voltage rated: 16 V  [0402]  (hidden comment: 0.1u)
C39  voltage rated: 16 V  [0402]  (hidden comment: 0.1u)
C40  voltage rated: 50 V  [0402]  (hidden comment: 1000p)
D10  LED, Red  value Red  [0402 - LED]
D11  CDBQR0130L  [0402 - DIODE]
Q10  DMN2004DWK  [SC70-6]  (parts A,B of 2)
Q11  DMN2004DWK  [SC70-6]  (part A of 2)
R28  47k  [0402]
R29  1Meg  [0402]
R30  1Meg  [0402]
R31  2.2k  [0402]
R32  1Meg  [0402]
R33  1Meg  [0402]
R34  2.2k  [0402]
R35  56k  [0402]
SW1  EVQP7C  [EVQP7C]  (value not drawn)
U9  CC2538  [QFN56]  (parts A,B,C,D,E,F of 6)
Y2  FA-128  frequency: 32 MHz  [FA-128]

### Ports
BatteryPackDetect, BatteryPackPowerEn, BLDR_CTRL, BLDR_RX, BLDR_TX, CHG_EN, current_waveform, currentMeasureEn, EXT_VOLT_SEL, EXT_VOLT_WAVE, I2C_SCL, I2C_SDA, RTC_CLKOUT, RTC_CS, SPI_MISO, SPI_MOSI, SPI_SCK, SW_A0, SW_A1, SW_EN, TCK, TDO, TMS, VCAP, VCAP_LOOPBACK, VCC3_LDO_EN, voltageMeasureEn, VoltageTrigger, Vref_Buf, ~{FRAM_CS}, ~{RDY_IN}, ~{RESET}

### Nets
GND: B1.2(GND) B1.5(GND) B1.6(GND) C27.2 C28.2 C29.2 C30.2 C31.2 C32.2 C33.2 C34.2 C35.2 C36.2 C37.2 C38.2 C39.2 C40.2 Q10.1(S2) Q10.4(S1) Q11.1(S2) R33.2 R35.2 SW1.2 U9.1(DGND_USB) U9.57(PAD) Y2.2 Y2.4
VCC_MCU: C28.1 C30.1 C31.1 C32.1 C33.1 C34.1 C35.1 C38.1 C39.1 R29.1 R30.1 R31.2 R32.1 U9.10(DVDD) U9.15(DVDD) U9.24(DVDD) U9.33(AVDD) U9.36(AVDD) U9.39(AVDD) U9.40(AVDD) U9.41(AVDD) U9.43(AVDD_GUARD) U9.55(DVDD)
VCC_SENSE: U9.23(PA7)
BatteryPackDetect: U9.52(PB3) ; port BatteryPackDetect
BLD_CTRL: U9.18(PA2) ; port BLDR_CTRL
BLD_RX: U9.16(PA0) ; port BLDR_RX
BLD_TX: U9.17(PA1) ; port BLDR_TX
CC2538_RF_N: B1.3(Bal-) U9.38(RF_N)
CC2538_RF_P: B1.4(Bal+) U9.37(RF_P)
current_waveform: U9.19(PA3) ; port current_waveform
currentMeasureEn: U9.13(PC1) ; port currentMeasureEn
EXT_VOLT_SEL: U9.49(PB6) ; port EXT_VOLT_SEL
EXT_VOLT_WAVE: U9.21(PA5) ; port EXT_VOLT_WAVE
I2C_SCL: U9.53(PB2) ; port I2C_SCL
I2C_SDA: U9.54(PB1) ; port I2C_SDA
PD3: D10.2 U9.29(PD3)
~{RDY_IN}: D11.2 Q10.5(G1) ; port ~{RDY_IN}  [also labelled TDO]
~{READY}: D11.1 Q11.6(D2) R28.2
~{RESET}: R34.2 ; port ~{RESET}
RTC_CLKOUT: U9.44(PD6/XOSC32K_Q1) ; port RTC_CLKOUT
RTC_CS: U9.30(PD4) ; port RTC_CS
SPI_MISO: U9.5(PB0) ; port SPI_MISO
SPI_MOSI: U9.50(PB5) ; port SPI_MOSI
SPI_SCK: U9.51(PB4) ; port SPI_SCK  [project net SPI_CLK]
SW_A0: U9.7(PC6) ; port SW_A0
SW_A1: U9.8(PC5) ; port SW_A1
SW_EN: U9.25(PD0) ; port SW_EN
TCK: U9.47(JTAG_TCK) ; port TCK
TDO: Q10.3(D1) R29.2 U9.48(PB7) ; port TDO
TMS: U9.46(JTAG_TMS) ; port TMS
VCAP: R28.1 ; port VCAP
VCAP_LOOPBACK: Q10.2(G2) R33.1 ; port VCAP_LOOPBACK
voltageMeasureEn: U9.14(PC0) ; port voltageMeasureEn
VoltageTrigger: U9.12(PC2) ; port VoltageTrigger
Vref_Buf: U9.20(PA4) ; port Vref_Buf
NetANT1_1: ANT1.1 B1.1(UB)
NetC27_1: C27.1 C29.1 U9.32(DCOUPL2) U9.56(DCOUPL1)
NetC36_1: C36.1 U9.34(XOSC32M_Q1) Y2.1
NetC37_1: C37.1 U9.35(XOSC32M_Q2) Y2.3
NetC40_1: C40.1 R34.1 U9.28(~{RESET})
NetD10_1: D10.1 R31.1
NetQ10_6: Q10.6(D2) R32.2 U9.31(PD5)
NetQ11_2: Q11.2(G2) U9.22(PA6)
NetQ13_5: U9.6(PC7) ; port BatteryPackPowerEn
NetR4_1: U9.27(PD2) ; port CHG_EN
NetR30_2: R30.2 SW1.1 U9.9(PC4)
NetR35_1: R35.1 U9.42(R_BIAS)
NetU4_1: U9.26(PD1) ; port ~{FRAM_CS}
NetU9_11: U9.11(PC3) ; port VCC3_LDO_EN

Not connected (* = marked no-connect by the designer): U9 2(USB_P)* 3(USB_N)* 4(DVDD_USB)* 45(PD7/XOSC32K_Q2)*

### Layout directives
differential pair: CC2538_RF_N, CC2538_RF_P

### Notes on the sheet
- Synchronize measurement. Once the device is ready, assert Gate, and read the TDO pin. If TDO pin reads high, all the units are ready.
- Title
- Date:
- Author:
- Revision:
- Sheet
- of
- University of Michigan
- File:

### Library data of the parts
ANT1 = 2450AT45A100: 2.45 GHz High Gain SMD Chip Antenna; Supplier 1: Digi-Key; Supplier Part Number 1: 712-1012-1-ND
B1 = 2450BM15A0002E: 2.45 GHz Balun for TI CC253X; Supplier 1: Digi-Key; Supplier Part Number 1: 712-1536-1-ND
C27-C33 C35 C38 C39 = GRM155R71C104KA88D: as C16 on sheet fram_rtc; tolerance: 10%; package: 0402; Supplier 1: Digi-Key; Supplier Part Number 1: 490-3261-1-ND; Value: 0.1u; Temperature Coefficient: X7R; Manufacturer Part Number: GRM155R71C104KA88D
C34 = C0402C221K5RACTU: 220pF ±10% 50V Ceramic Capacitor X7R 0402; Manufacture: Kemet; tolerance: 10%; package: 0402; Supplier 1: Digi-Key; Supplier Part Number 1: 399-1030-1-ND; Value: 220p; Temperature Coefficient: X7R; Manufacturer Part Number: C0402C221K5RACTU
C36 C37 = 500R07S120GV4T: 12pF ±2% 50V Ceramic Capacitor C0G, NP0 0402; Manufacture: Johanson Technology Inc.; tolerance: 2%; package: 0402; Temperature Coefficient: C0G, NP0; Manufacturer Part Number: 500R07S120GV4T; Supplier 1: Digi-Key; Supplier Part Number 1: 712-1256-1-ND; Value: 12p
C40 = C1005C0G1H102J050BA: 1000pF ±5% 50V Ceramic Capacitor C0G, NP0 0402; Manufacture: TDK; tolerance: 5%; package: 0402; Supplier 1: Digi-Key; Supplier Part Number 1: 445-6846-1-ND; Value: 1000p; Temperature Coefficient: C0G, NP0; Manufacturer Part Number: C1005C0G1H102J050BA
D10 = SML-P12UTT86: Red 620nm LED Indication - Discrete 2V 2-SMD; Manufacturer: Rohm Semiconductor; Current @ VF: 20 mA; package: 0402; Supplier 1: Digi-Key; Supplier Part Number 1: 511-1593-1-ND; Forward Voltage: 2 V; Manufacturer Part Number: SML-P12UTT86; Wavelength: 620 nm
D11 = CDBQR0130L: Diode Schottky 30V 100mA Surface Mount 0402/SOD-923F; Manufacturer: Comchip Technology; Forward Voltage @ If: 350 mV @ 10 mA; Supplier 1: Digi-Key; Supplier Part Number 1: 641-1271-1-ND; Manufacturer Part Number: CDBQR0130L; current: 100 mA; reverse voltage: 30 V; diode type: Schottky
Q10 Q11 = DMN2004DWK: DUAL N-CHANNEL ENHANCEMENT MODE MOSFET; Supplier 1: Digi-Key; Supplier Part Number 1: DMN2004DWKDICT-ND
R28 = CRCW040247K0FKED: as R2 on sheet charging; Tolerance: 1%; Power: 1/16 W; package: 0402; Supplier 1: Digi-Key; Supplier Part Number 1: 541-47.0KLCT-ND; value: 47k; Manufacturer Part Number: CRCW040247K0FKED
R29 R30 R32 R33 = CRCW04021M00FKED: as R4 on sheet charging; Tolerance: 1%; Power: 1/16 W; Supplier 1: Digi-Key; Supplier Part Number 1: 541-1.00MLCT-ND; package: 0402; value: 1Meg; Manufacturer Part Number: CRCW04021M00FKED
R31 R34 = CRCW04022K20FKED: RES SMD 2.2K OHM 1% 1/16W 0402; Manufacturer: Vishay Dale; Temperature Coefficient: 100 ppm/C; Tolerance: 1%; Power: 1/16 W; package: 0402; Supplier 1: Digi-Key; Supplier Part Number 1: 541-2.20KLCT-ND; value: 2.2k; Manufacturer Part Number: CRCW04022K20FKED
R35 = CRCW040256K0FKED: RES SMD 56K OHM 1% 1/16W 0402; Manufacturer: Vishay Dale; Temperature Coefficient: 100 ppm/C; Power: 1/16 W; package: 0402; Supplier 1: Digi-Key; Supplier Part Number 1: 541-56.0KLCT-ND; Tolerance: 1%; value: 56k; Manufacturer Part Number: CRCW040256K0FKED
SW1 = EVQP7C: 3.5 mm×2.9 mm Side-operational SMD  Light Touch Switches; Supplier 1: Digi-Key; Supplier Part Number 1: P16769CT-ND
U9 = CC2538: A Powerful System-On-Chip for 2.4-GHz IEEE 802.15.4, 6LoWPAN  and ZigBee Applications; Supplier 1: Digi-Key; Supplier Part Number 1: 296-35797-1-ND
Y2 = FA-128: MHz Range Crystal Unit; Load capatance: 10 pF; ESR: 60; stability: 20 ppm; Supplier 1: Digi-Key; Supplier Part Number 1: SER3800CT-ND

## Sheet power_supply.SchDoc: Triumvi - Power supply
size Letter; Author: Ye-Sheng Kuo; Revision: 12; SheetNumber: 2; SheetTotal: 9
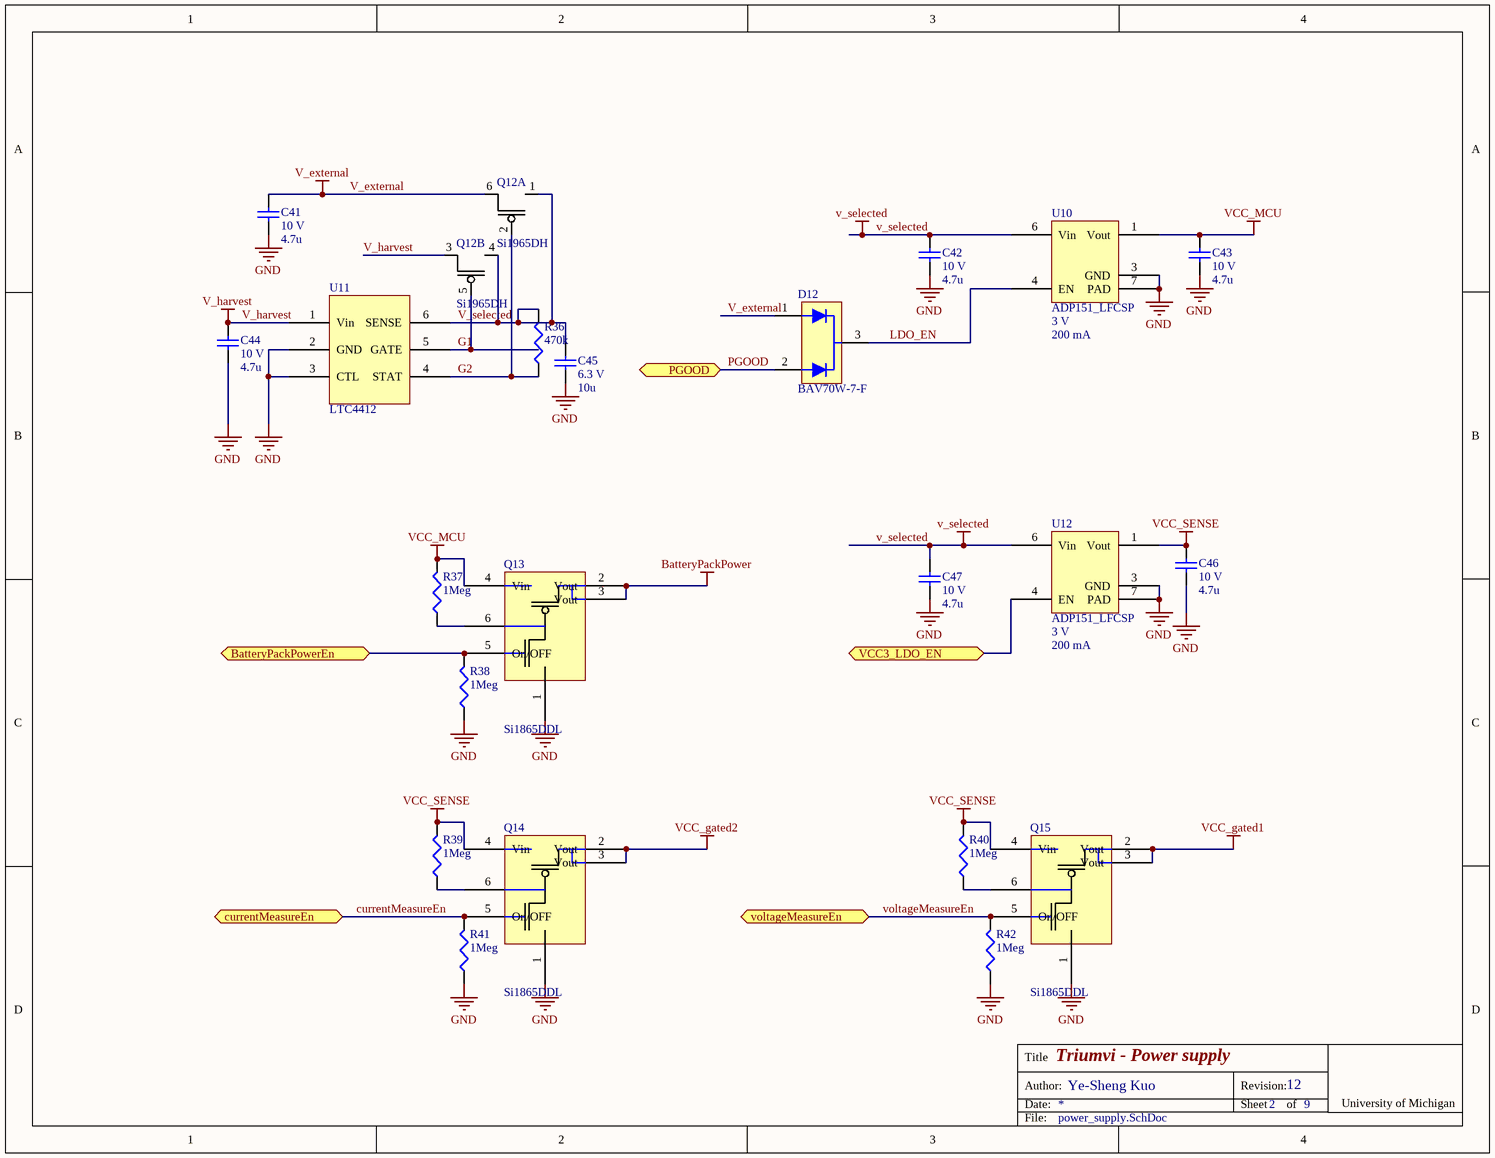
[diagram p8: power_supply.SchDoc]

### Parts
C41  voltage rated: 10 V  [0603]  (hidden comment: 4.7u)
C42  voltage rated: 10 V  [0603]  (hidden comment: 4.7u)
C43  voltage rated: 10 V  [0603]  (hidden comment: 4.7u)
C44  voltage rated: 10 V  [0603]  (hidden comment: 4.7u)
C45  voltage rated: 6.3 V  [0603]  (hidden comment: 10u)
C46  voltage rated: 10 V  [0603]  (hidden comment: 4.7u)
C47  voltage rated: 10 V  [0603]  (hidden comment: 4.7u)
D12  BAV70W-7-F  [SOT323]
Q12  Si1965DH  [SC70-6]  (parts A,B of 2)
Q13  Si1865DDL  [SC70-6]
Q14  Si1865DDL  [SC70-6]
Q15  Si1865DDL  [SC70-6]
R36  470k  [0402]
R37  1Meg  [0402]
R38  1Meg  [0402]
R39  1Meg  [0402]
R40  1Meg  [0402]
R41  1Meg  [0402]
R42  1Meg  [0402]
U10  ADP151_LFCSP  Voltage: 3 V  Current: 200 mA  [CP-6-3]
U11  LTC4412  [TSOT-23]
U12  ADP151_LFCSP  Voltage: 3 V  Current: 200 mA  [CP-6-3]

### Ports
BatteryPackPowerEn, currentMeasureEn, PGOOD, VCC3_LDO_EN, voltageMeasureEn

### Nets
BatteryPackPower: Q13.2(Vout) Q13.3(Vout)
GND: C41.2 C42.2 C43.2 C44.2 C45.2 C46.2 C47.2 Q13.1(S1) Q14.1(S1) Q15.1(S1) R38.2 R41.2 R42.2 U10.3(GND) U10.7(PAD) U11.2(GND) U11.3(CTL) U12.3(GND) U12.7(PAD)
V_external: C41.1 D12.1 Q12.6(D1)
V_harvest: C44.1 Q12.3(D2) U11.1(Vin)
v_selected: C42.1 C45.1 C47.1 Q12.1(S1) Q12.4(S2) R36.1 U10.6(Vin) U11.6(SENSE) U12.6(Vin)
VCC_gated1: Q15.2(Vout) Q15.3(Vout)
VCC_gated2: Q14.2(Vout) Q14.3(Vout)
VCC_MCU: C43.1 Q13.4(Vin) R37.1 U10.1(Vout)
VCC_SENSE: C46.1 Q14.4(Vin) Q15.4(Vin) R39.1 R40.1 U12.1(Vout)
currentMeasureEn: Q14.5(On/OFF) R41.1 ; port currentMeasureEn
G1: Q12.5(G2) U11.5(GATE)
G2: Q12.2(G1) R36.2 U11.4(STAT)
LDO_EN: D12.3 U10.4(EN)
PGOOD: D12.2 ; port PGOOD
voltageMeasureEn: Q15.5(On/OFF) R42.1 ; port voltageMeasureEn
NetQ13_5: Q13.5(On/OFF) R38.1 ; port BatteryPackPowerEn
NetQ13_6: Q13.6(D1) R37.2
NetQ14_6: Q14.6(D1) R39.2
NetQ15_6: Q15.6(D1) R40.2
NetU9_11: U12.4(EN) ; port VCC3_LDO_EN

### Notes on the sheet
- Title
- Date:
- Author:
- Revision:
- Sheet
- of
- University of Michigan
- File:

### Library data of the parts
C41-C44 C46 C47 = CGB3B1X5R1A475K055AC: as C4 on sheet charging; tolerance: 10%; package: 0603; Supplier 1: Digi-Key; Supplier Part Number 1: 445-7482-1-ND; Value: 4.7u; Temperature Coefficient: X5R; Manufacturer Part Number: CGB3B1X5R1A475K055AC
C45 = C1608X5R0J106M080AB: as C20 on sheet iv_sensing; tolerance: 20%; package: 0603; Temperature Coefficient: X5R; Supplier 1: Digi-Key; Supplier Part Number 1: 445-4112-1-ND; Value: 10u; Manufacturer Part Number: C1608X5R0J106M080AB
D12 = BAV70W-7-F: Diode Array 1 Pair Common Cathode Standard 75V 150mA Surface Mount SC-70, SOT-323; Manufacturer: Diodes Incorporated; Forward Voltage @ If: 1.25 V @ 150 mA; Supplier 1: Digi-Key; Supplier Part Number 1: BAV70W-FDICT-ND; Manufacturer Part Number: BAV70W-7-F; current: 150 mA; reverse voltage: 75 V; diode type: Standard
Q12 = Si1965DH: Dual P-Channel 12 V (D-S) MOSFET; Supplier 1: Digi-Key; Supplier Part Number 1: SI1965DH-T1-GE3CT-ND
Q13-Q15 = Si1865DDL: Load Switch with Level-Shift; Supplier 1: Digi-Key; Supplier Part Number 1: SI1865DDL-T1-GE3CT-ND
R36 = CRCW0402470KJNED: RES SMD 470K OHM 5% 1/16W 0402; Manufacturer: Vishay Dale; Temperature Coefficient: 100 ppm/C; Tolerance: 5%; Power: 1/16 W; package: 0402; Supplier 1: Digi-Key; Supplier Part Number 1: 541-470KJCT-ND; value: 470k; Manufacturer Part Number: CRCW0402470KJNED
R37-R42 = CRCW04021M00FKED: as R4 on sheet charging; Tolerance: 1%; Power: 1/16 W; Supplier 1: Digi-Key; Supplier Part Number 1: 541-1.00MLCT-ND; package: 0402; value: 1Meg; Manufacturer Part Number: CRCW04021M00FKED
U10 U12 = ADP151_LFCSP: Ultralow Noise, 200 mA,  CMOS Linear Regulator; Supplier 1: Digi-Key; Supplier Part Number 1: ADP151ACPZ-3.0-R7CT-ND
U11 = LTC4412: Low Loss PowerPath Controller in ThinSOT; Supplier 1: Digi-Key; Supplier Part Number 1: LTC4412ES6#TRMPBFCT-ND

## Nets that join several sheets
BatteryPackPower: connector (J1.4), power_supply (Q13.2 Q13.3)
GND: charging (9 pins), connector (J1.5 J1.9 P1.5 P2.2), ct_switching (Q6.2 Q7.2 Q8.2 Q9.2), energy_harvesting (9 pins), fram_rtc (6 pins), iv_sensing (15 pins), mcu (27 pins), power_supply (19 pins)
V_Batt: charging (C5.1 Q1.2 U2.3), connector (J1.10)
V_external: charging (D3.2 Q1.3), power_supply (C41.1 D12.1 Q12.6)
V_harvest: charging (C2.2 D1.2 U1.5), energy_harvesting (C13.1 L1.1 U3.6), power_supply (C44.1 Q12.3 U11.1)
V_Prog: charging (D1.1 D3.1 Q1.1 R3.1), connector (P1.1 P2.1), fram_rtc (D9.2 R11.1)
VCC_gated1: iv_sensing (7 pins), power_supply (Q15.2 Q15.3)
VCC_gated2: iv_sensing (5 pins), power_supply (Q14.2 Q14.3)
VCC_MCU: fram_rtc (7 pins), mcu (23 pins), power_supply (C43.1 Q13.4 R37.1 U10.1)
VCC_SENSE: mcu (U9.23), power_supply (6 pins)
BatteryPackDetect: connector (J1.3), mcu (U9.52)
BLD_CTRL: connector (P2.5), mcu (U9.18)
BLD_RX: connector (P2.4), mcu (U9.16)
BLD_TX: connector (P2.3), mcu (U9.17)
CT1: ct_switching (D5.3 D7.3), energy_harvesting (U3.2)
CT2: ct_switching (D4.3 D6.3), energy_harvesting (U3.1)
current_waveform: iv_sensing (U6.6), mcu (U9.19)
currentMeasureEn: ct_switching (Q6.1 Q7.1 Q8.1 Q9.1), mcu (U9.13), power_supply (Q14.5 R41.1)
EXT_VOLT_SEL: connector (J1.11), mcu (U9.49)
EXT_VOLT_WAVE: connector (J1.12), mcu (U9.21)
I2C_SCL: connector (J1.1), mcu (U9.53)
I2C_SDA: connector (J1.2), mcu (U9.54)
in+: ct_switching (D4.1 Q4.3 R9.1), iv_sensing (U6.3)
in-: ct_switching (D5.1 Q2.3 R9.2), iv_sensing (U6.2)
NetQ13_5: mcu (U9.6), power_supply (Q13.5 R38.1)
NetR4_1: charging (R4.1 U1.3), mcu (U9.27)
NetU4_1: fram_rtc (U4.1), mcu (U9.26)
NetU9_11: mcu (U9.11), power_supply (U12.4)
PGOOD: energy_harvesting (U3.10), power_supply (D12.2)
~{RDY_IN}: connector (J1.8), mcu (D11.2 Q10.5)
~{RESET}: connector (P1.3 P2.6), mcu (R34.2)
RTC_CLKOUT: fram_rtc (Y1.3), mcu (U9.44)
RTC_CS: fram_rtc (Y1.8), mcu (U9.30)
SPI_CLK: fram_rtc (U4.6 Y1.4), mcu (U9.51)
SPI_MISO: fram_rtc (U4.2 Y1.5), mcu (U9.5)
SPI_MOSI: fram_rtc (U4.5 Y1.10), mcu (U9.50)
SW_A0: iv_sensing (U5.1), mcu (U9.7)
SW_A1: iv_sensing (U5.14), mcu (U9.8)
SW_EN: iv_sensing (U5.2), mcu (U9.25)
TCK: connector (P1.4), mcu (U9.47)
TDO: connector (P1.6), mcu (Q10.3 R29.2 U9.48)
TMS: connector (P1.2), mcu (U9.46)
VCAP: connector (J1.7), energy_harvesting (7 pins), mcu (R28.1)
VCAP_LOOPBACK: connector (J1.6), mcu (Q10.2 R33.1)
voltageMeasureEn: mcu (U9.14), power_supply (Q15.5 R42.1)
VoltageTrigger: iv_sensing (R21.2 U8.1), mcu (U9.12)
Vref_Buf: iv_sensing (R23.1 U6.5 U7.1 U7.2), mcu (U9.20)